# EAGLE design transistor_op-amp_v2 (EAGLE 7.7.0)
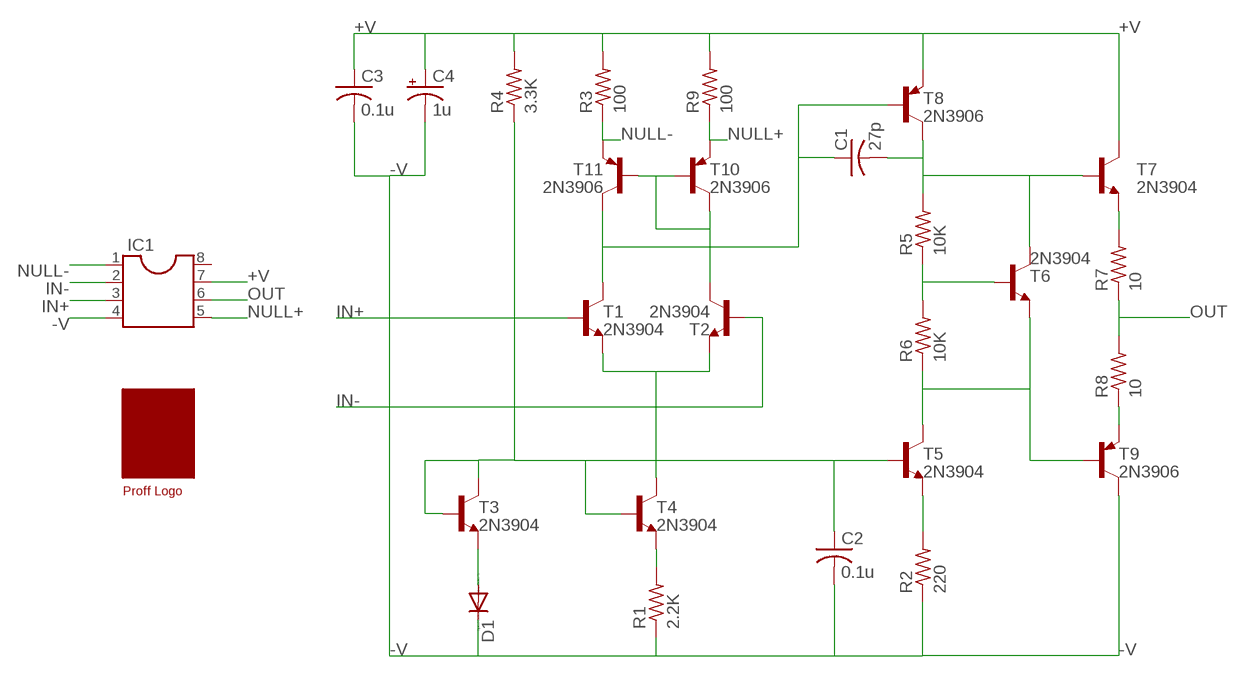
[diagram p0: schematic, sheet 1]

## Parts
C1  27p  C-US050-024X044  [C050-024X044]
C2  0.1u  C-US050-024X044  [C050-024X044]
C3  0.1u  C-US050-024X044  [C050-024X044]
C4  1u  CPOL-USE2.5-5  [E2,5-5]
D1  DIODE-D-7.5  [D-7.5]
IC1  DIL8S  [SOCKET-08]
R1  2.2K  R-US_0207/7  [0207/7]
R2  220  R-US_0207/7  [0207/7]
R3  100  R-US_0207/7  [0207/7]
R4  3.3K  R-US_0207/7  [0207/7]
R5  10K  R-US_0207/7  [0207/7]
R6  10K  R-US_0207/7  [0207/7]
R7  10  R-US_0207/7  [0207/7]
R8  10  R-US_0207/7  [0207/7]
R9  100  R-US_0207/7  [0207/7]
T1  2N3904  [TO92]
T2  2N3904  [TO92]
T3  2N3904  [TO92]
T4  2N3904  [TO92]
T5  2N3904  [TO92]
T6  2N3904  [TO92]
T7  2N3904  [TO92]
T8  2N3906  [TO92]
T9  2N3906  [TO92]
T10  2N3906  [TO92]
T11  2N3906  [TO92]
U$1  PROFF  [PROFF]

## Nets
+V: C3.1 C4.+ IC1.7 R3.2 R4.2 R9.2 T7.1(C) T8.3(E)
-V: C2.2 C3.2 C4.- D1.C IC1.4 R1.1 R2.1 T9.1(C)
IN+: IC1.3 T1.2(B)
IN-: IC1.2 T2.2(B)
N$1: D1.A T3.3(E)
N$2: C2.1 R4.1 T3.1(C) T3.2(B) T4.2(B) T5.2(B)
N$3: R1.2 T4.3(E)
N$4: R2.2 T5.3(E)
N$6: T1.3(E) T2.3(E) T4.1(C)
N$8: R7.2 T7.3(E)
N$9: R6.1 T5.1(C) T6.3(E) T9.2(B)
N$10: R5.1 R6.2 T6.2(B)
N$11: C1.2 R5.2 T6.1(C) T7.2(B) T8.1(C)
N$13: R8.1 T9.3(E)
N$15: C1.1 T1.1(C) T8.2(B) T11.1(C)
N$40: T2.1(C) T10.1(C) T10.2(B) T11.2(B)
NULL+: IC1.5 R9.1 T10.3(E)
NULL-: IC1.1 R3.1 T11.3(E)
OUT: IC1.6 R7.1 R8.2
Unconnected: IC1.8

## Library data of the parts
C1-C3 = resistor:C-US: CAPACITOR, American symbol
C4 = rcl:CPOL-US: POLARIZED CAPACITOR, American symbol
D1 = diode:DIODE-: DIODE
IC1 = ic-package:DIL8: Dual In Line / Socket
R1-R9 = resistor:R-US_: RESISTOR, American symbol
T1-T6 = transistor:2N3904: NPN TRANSISTOR
T7 = transistor-npn:2N3904: NPN Transistor
T8-T11 = transistor-pnp:2N3906: PNP Transistor
U$1 = logo:PROFF

## Board
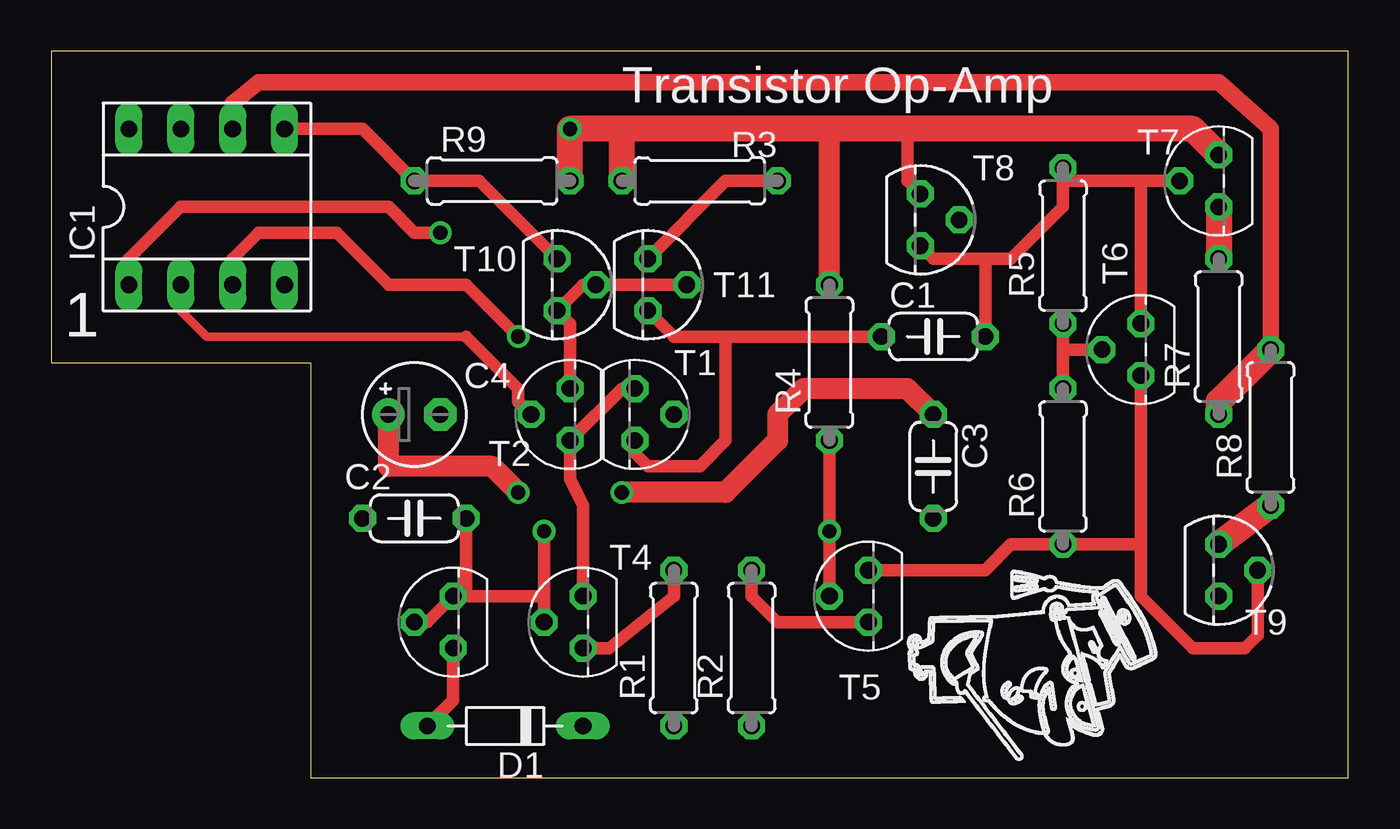
[diagram p1: board, top side]
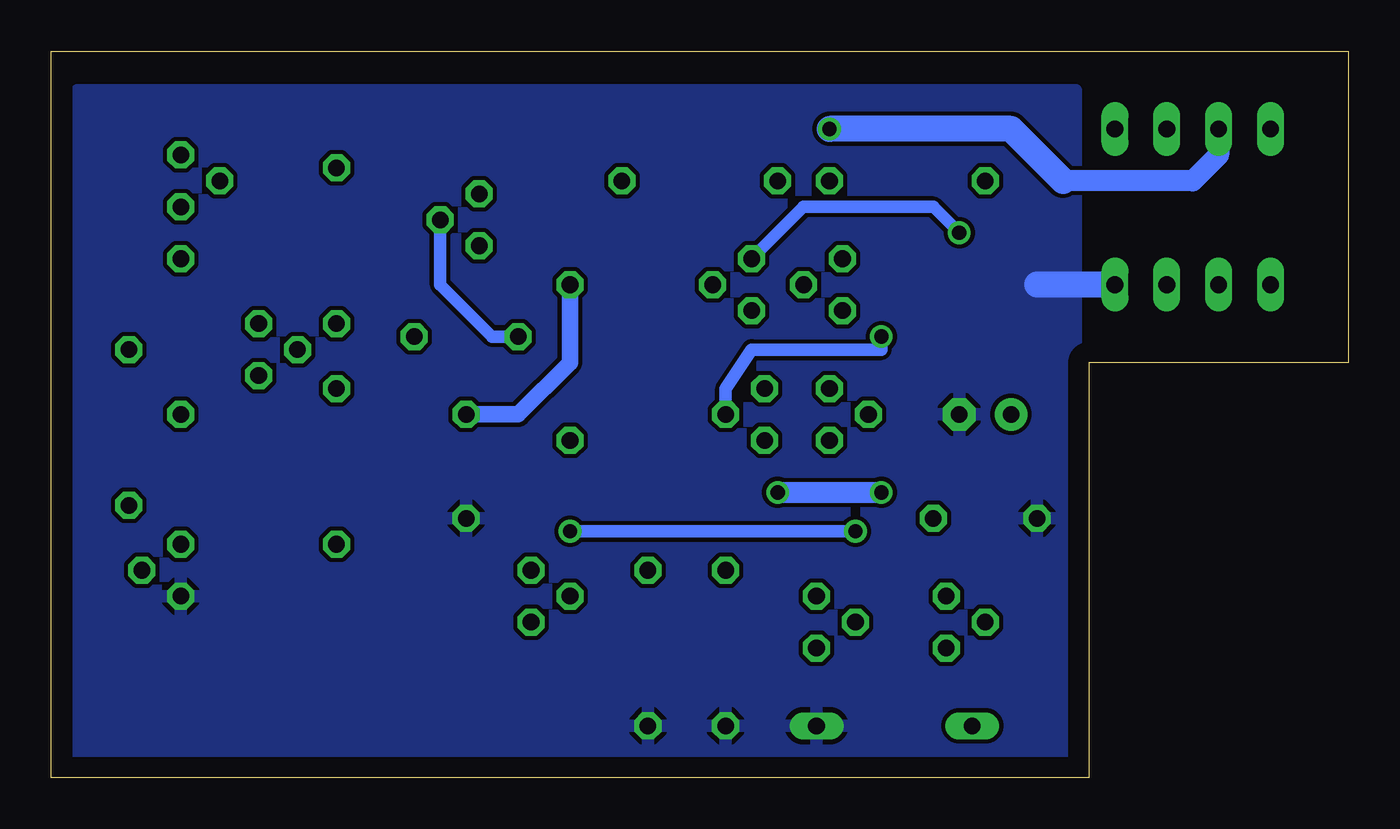
[diagram p2: board, bottom side, seen from below]

Size 63.5 x 35.56 mm. Coordinates in mm from the lower left corner, seen from the top.
Outline: 12.7,0 63.5,0 63.5,35.56 0,35.56 0,20.32 12.7,20.32 12.7,0
Copper layers (1*16): Top 0.035mm / dielectric 1.5mm / Bottom 0.035mm
Design rules "default": minimum track width 10mil, minimum drill 24mil, track to track 8mil, track to pad 8mil, pad to pad 8mil, via to via 8mil, smd to smd 8mil, copper to edge 40mil, drill to drill 8mil, minimum pad ring 10mil, minimum via ring 8mil, stop-mask expansion 4mil, vias tented up to drill 0mil, thermal gap 10mil

### Footprints (pad centres in the part's own frame; a part is rotated, then mirrored left to right if it is on the bottom)
C050-024X044 = drill 0.813 octagon: 1 -2.54,0; 2 2.54,0
E2,5-5 = drill 0.813 pad 1.6: + -1.27,0 | drill 0.813 pad 1.6 octagon: - 1.27,0
D-7.5 = drill 0.813 long: A 3.81,0; C -3.81,0
SOCKET-08 = drill 0.813 long: 1 -3.81,-3.81; 2 -1.27,-3.81; 3 1.27,-3.81; 4 3.81,-3.81; 5 3.81,3.81; 6 1.27,3.81; 7 -1.27,3.81; 8 -3.81,3.81
0207/7 = drill 0.813 octagon: 1 -3.81,0; 2 3.81,0
TO92 = drill 0.813 octagon: 1 1.27,0; 2 0,1.905; 3 -1.27,0

### Placement (x,y rotation side)
C1  43.18,21.59 0 top
C2  17.78,12.7 180 top
C3  43.18,15.24 270 top
C4  17.78,17.78 0 top
D1  22.23,2.54 180 top
IC1  7.62,27.94 0 top
R1  30.48,6.35 90 top
R2  34.29,6.35 90 top
R3  31.75,29.21 180 top
R4  38.1,20.32 90 top
R5  49.53,26.04 90 top
R6  49.53,15.24 90 top
R7  57.15,21.59 90 top
R8  59.69,17.14 90 top
R9  21.59,29.21 0 top
T1  28.57,17.78 270 top
T2  25.4,17.78 90 top
T3  19.68,7.62 90 top
T4  26.04,7.62 90 top
T5  40.01,8.89 90 top
T6  53.34,20.95 90 top
T7  57.15,29.21 90 top
T8  42.55,27.3 270 top
T9  57.15,10.16 270 top
T10  24.77,24.13 270 top
T11  29.21,24.13 270 top
U$1  41.91,10.16 270 top

### Tracks (layer width: path | path; a pad name or v marks a point on that pad's centre or on a via)
+V  (via drill 0.7)
  Top 0.61: T8.3 41.91,29.21 41.91,31.75
  Top 1.016: R4.2 38.1,31.75 | C3.1 41.91,19.05 36.83,19.05 35.56,17.78 35.56,16.51 33.02,13.97 v27.94,13.97 | v22.86,13.97 21.59,15.24 16.51,15.24 C4.+
  Top 1.27: T7.1 55.88,31.75 41.91,31.75 38.1,31.75 27.94,31.75 | 27.94,31.75 v25.4,31.75 R9.2 | R3.2 27.94,31.75
  Bottom 0.813: C3.1 40.64,17.78 38.1,20.32 R4.2
  Bottom 1.016: IC1.7 6.35,30.48 7.62,29.21 13.97,29.21 | v27.94,13.97 v22.86,13.97
  Bottom 1.27: 13.97,29.21 16.51,31.75 v25.4,31.75
-V
  Bottom 1.27: IC1.4 15.24,24.13
  pour Bottom: 13.34,0.64 13.34,33.66 62.23,33.66 62.23,0.64
IN+  (via drill 0.7)
  Top 0.61: v22.86,21.59 20.32,24.13 16.51,24.13 13.97,26.67 10.16,26.67 8.89,25.4 IC1.3
  Bottom 0.61: T1.2 30.48,19.05 29.21,20.95 22.86,20.95 v22.86,21.59
IN-
  Top 0.406: IC1.2 6.35,22.86 7.62,21.59 20.32,21.59
  Top 0.61: 20.32,21.59 22.86,19.05 22.86,18.41 T2.2
N$1
  Top 0.61: T3.3 19.68,3.81 D1.A
N$2  (via drill 0.7)
  Top 0.61: T5.2 v38.1,12.06 R4.1 | T3.2 18.41,7.62 T3.1 20.32,8.89 | 24.13,8.89 20.32,8.89 | v24.13,12.06 24.13,8.89 | 24.13,8.89 T4.2 | C2.1 20.32,8.89
  Bottom 0.61: v38.1,12.06 v24.13,12.06
N$3
  Top 0.61: T4.3 27.3,6.35 30.48,8.89 R1.2
N$4
  Top 0.61: T5.3 35.56,7.62 34.29,8.89 R2.2
N$6
  Top 0.61: T4.1 26.04,13.34 25.4,14.61 T2.3 27.94,19.05 T1.3
N$8
  Top 1.27: T7.3 R7.2
N$9
  Top 0.61: T5.1 45.72,10.16 46.99,11.43 R6.1 53.34,11.43 | T6.3 53.34,11.43 | 53.34,11.43 53.34,8.89 55.88,6.35 58.42,6.35 59.05,6.99 T9.2
N$10
  Top 0.61: T6.2 49.53,20.95 | R6.2 49.53,20.95 | 49.53,20.95 R5.1
N$11
  Top 0.61: 53.34,29.21 49.53,29.21 R5.2 49.53,27.94 46.99,25.4 45.72,25.4 | T7.2 53.34,29.21 | 53.34,29.21 T6.1 | C1.2 45.72,25.4 | 45.72,25.4 43.18,25.4 T8.1
N$13
  Top 1.27: R8.1 T9.3
N$15
  Top 0.61: T1.1 28.57,15.88 29.21,15.24 31.75,15.24 33.02,16.51 33.02,21.59 | 33.02,21.59 C1.1 | T11.1 30.48,21.59 33.02,21.59
  Bottom 0.61: C1.1 41.91,21.59 44.45,24.13 T8.2
N$40
  Top 0.61: T2.1 25.4,22.23 T10.1 26.04,24.13 T10.2 T11.2
NULL+
  Top 0.61: T10.3 20.95,29.21 R9.1 15.24,31.75 IC1.5
NULL-  (via drill 0.7)
  Top 0.61: R3.1 33.02,29.21 T11.3 | IC1.1 3.81,25.4 6.35,27.94 16.51,27.94 17.78,26.67 v19.05,26.67
  Bottom 0.61: v19.05,26.67 20.32,27.94 26.67,27.94 T11.3
OUT
  Top 0.813: R8.2 59.69,31.75 57.15,34.04 10.16,34.04 8.89,33.02 IC1.6
  Top 1.27: R7.1 57.15,18.41 R8.2

### Text on the board
tNames: Transistor Op-Amp | 1